# Altium schematic sheet MCU.SchDoc: MCU
size A3; Author: DODANHLUONG; Revision: 1.0; SheetNumber: 4; SheetTotal: 6; ProjectTitle: KIT ARDUINO VERSION 1.0
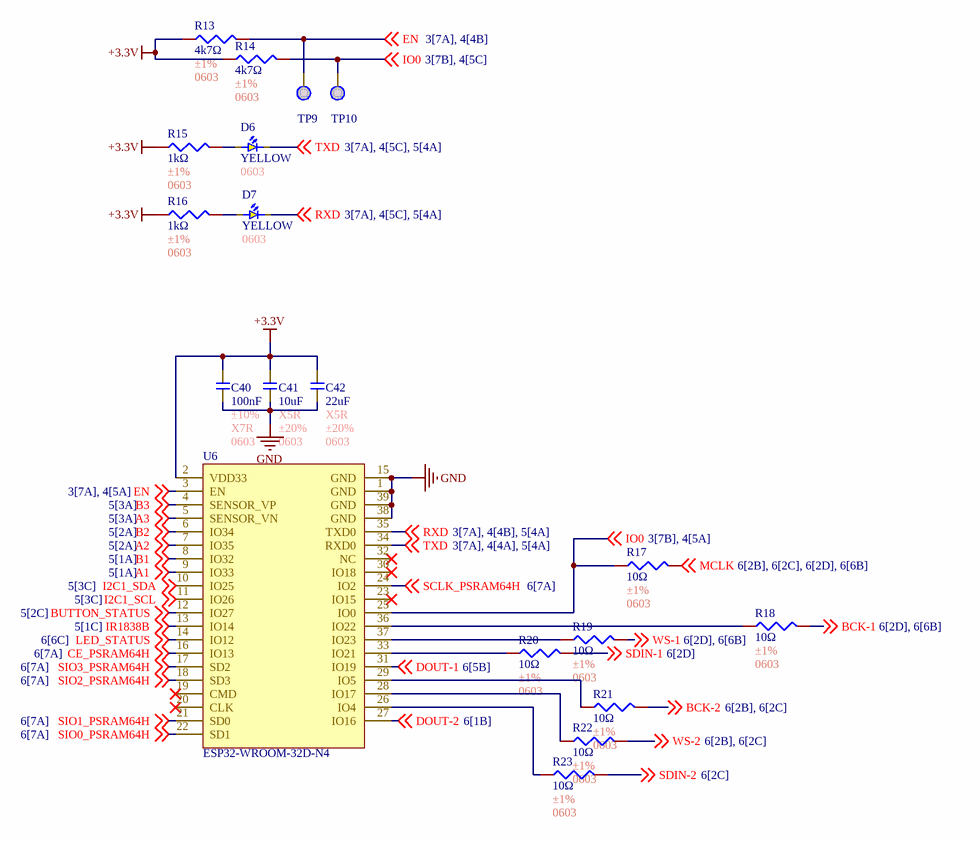
[diagram p0: MCU.SchDoc]

## Parts
C40  100nF  Tolerance: ±10%  Temperature Coefficient: X7R  Package: 0603  [C0603]
C41  10uF  Temperature Coefficient: X5R  Tolerance: ±20%  Package: 0603  [C0603]
C42  22uF  Temperature Coefficient: X5R  Tolerance: ±20%  Package: 0603  [C0603]
D6  YELLOW  Package: 0603  [LED0603]
D7  YELLOW  Package: 0603  [LED0603]
R13  4k7Ω  Tolerance: ±1%  Package: 0603  [R0603]
R14  4k7Ω  Tolerance: ±1%  Package: 0603  [R0603]
R15  1kΩ  Tolerance: ±1%  Package: 0603  [R0603]
R16  1kΩ  Tolerance: ±1%  Package: 0603  [R0603]
R17  10Ω  Tolerance: ±1%  Package: 0603  [R0603]
R18  10Ω  Tolerance: ±1%  Package: 0603  [R0603]
R19  10Ω  Tolerance: ±1%  Package: 0603  [R0603]
R20  10Ω  Tolerance: ±1%  Package: 0603  [R0603]
R21  10Ω  Tolerance: ±1%  Package: 0603  [R0603]
R22  10Ω  Tolerance: ±1%  Package: 0603  [R0603]
R23  10Ω  Tolerance: ±1%  Package: 0603  [R0603]
TP9  TP  [TP]  (value not drawn)
TP10  TP  [TP]  (value not drawn)
U6  ESP32-WROOM-32D-N4  [ESP32-WROOM-32D-N4]

## Nets
+3.3V: C40.2 C41.2 C42.2 R13.1 R14.1 R15.1 R16.1 U6.2(VDD33)
GND: C40.1 C41.1 C42.1 U6.1(GND) U6.15(GND) U6.38(GND) U6.39(GND)
A1: U6.9(IO33) ; off-sheet A1
A2: U6.7(IO35) ; off-sheet A2
A3: U6.5(SENSOR_VN) ; off-sheet A3
B1: U6.8(IO32) ; off-sheet B1
B2: U6.6(IO34) ; off-sheet B2
B3: U6.4(SENSOR_VP) ; off-sheet B3
BCK-1: R18.2 ; off-sheet BCK-1
BCK-2: R21.2 ; off-sheet BCK-2
BUTTON_STATUS: U6.12(IO27) ; off-sheet BUTTON_STATUS
CE_PSRAM64H: U6.16(IO13) ; off-sheet CE_PSRAM64H
DOUT-1: U6.31(IO19) ; off-sheet DOUT-1
DOUT-2: U6.27(IO16) ; off-sheet DOUT-2
EN: R13.2 TP9.1 U6.3(EN) ; off-sheet EN
I2C1_SCL: U6.11(IO26) ; off-sheet I2C1_SCL
I2C1_SDA: U6.10(IO25) ; off-sheet I2C1_SDA
IO0: R14.2 R17.1 TP10.1 U6.25(IO0) ; off-sheet IO0
IR1838B: U6.13(IO14) ; off-sheet IR1838B
LED_STATUS: U6.14(IO12) ; off-sheet LED_STATUS
MCLK: R17.2 ; off-sheet MCLK
RXD: D7.1 U6.35(TXD0) ; off-sheet RXD
SCLK_PSRAM64H: U6.24(IO2) ; off-sheet SCLK_PSRAM64H
SDIN-1: R20.2 ; off-sheet SDIN-1
SDIN-2: R23.2 ; off-sheet SDIN-2
SIO0_PSRAM64H: U6.22(SD1) ; off-sheet SIO0_PSRAM64H
SIO1_PSRAM64H: U6.21(SD0) ; off-sheet SIO1_PSRAM64H
SIO2_PSRAM64H: U6.18(SD3) ; off-sheet SIO2_PSRAM64H
SIO3_PSRAM64H: U6.17(SD2) ; off-sheet SIO3_PSRAM64H
TXD: D6.1 U6.34(RXD0) ; off-sheet TXD
WS-1: R19.2 ; off-sheet WS-1
WS-2: R22.2 ; off-sheet WS-2
NetD6_2: D6.2 R15.2
NetD7_2: D7.2 R16.2
NetR18_1: R18.1 U6.36(IO22)
NetR19_1: R19.1 U6.37(IO23)
NetR20_1: R20.1 U6.33(IO21)
NetR21_1: R21.1 U6.29(IO5)
NetR22_1: R22.1 U6.28(IO17)
NetR23_1: R23.1 U6.26(IO4)

Not connected (* = marked no-connect by the designer): U6 19(CMD)* 20(CLK)* 23(IO15)* 30(IO18)* 32(NC)*

## Notes on the sheet
- Author:
- Title:
- Size:
- A3
- Project:
- Revision:
- Modified Date:
- CheckedBy:
- Date:
- SW Version:

## Library data of the parts
C40 = C0603_100nF_±10%_X7R: 50V 100nF X7R ±10% 0603 Multilayer Ceramic Capacitors MLCC - SMD/SMT ROHS; Manufacturer: YAGEO; Mfr. Part #: CC0603KRX7R9BB104; LCSC Part #: C14663; Capacitance: 100nF; Link: https://www.lcsc.com/product-detail/C14663.html?s_z=n_capital%25200603%2520100nf
C41 = C0603_10uF_±10%_X7R: 25V 10uF X5R ±20% 0603 Multilayer Ceramic Capacitors MLCC - SMD/SMT ROHS; Manufacturer: YAGEO; Mfr. Part #: CC0603MRX5R8BB106; LCSC Part #: C596327; Capacitance: 10uF; Link: https://www.lcsc.com/product-detail/C596327.html?s_z=n_capital%25200603%252010uF%2520yageo
C42 = C0603_22uF_±20%_X5R: 6.3V 22uF X5R ±20% 0603 Multilayer Ceramic Capacitors MLCC - SMD/SMT ROHS; Manufacturer: YAGEO; Mfr. Part #: CC0603MRX5R5BB226; LCSC Part #: C109448; ComponentLink1Description: New link; ComponentLink1URL: *; Capacitance: 22uF; Link: https://www.lcsc.com/product-detail/C109448.html?s_z=n_capital%25200603%252022uf%2520yageo
D6 D7 = D0603_YELLOW: 25mcd~40mcd Water Clear -40℃~+85℃ 624nm Red 120° 60mW 0402 LED Indication - Discrete ROHS; Manufacturer: XINGLIGHT; Mfr. Part #: XL-1005UGC; Voltage - Forward(Vf): 3V; LCSC Part #: C965793; Power(Watts): 60mW; Link: https://www.lcsc.com/product-detail/C136765.html?s_z=n_LED%25200402%2520RED; Illumination Color: YELLOW
R13 R14 = R0603_4k7Ω_±1%: 62.5mW Thick Film Resistor 50V ±1% ±200ppm/℃ 10Ω 0402 Chip Resistor - Surface Mount ROHS; Manufacturer: YAGEO; Mfr. Part #: RC0402FR-0710RL; LCSC Part #: C138066; Resistance: 4k7Ω; Link: https://www.lcsc.com/product-detail/C138066.html?s_z=n_resistor%25200402%252010R
R15 R16 = R0603_1kΩ_±1%: 62.5mW Thick Film Resistor 50V ±1% ±200ppm/℃ 10Ω 0402 Chip Resistor - Surface Mount ROHS; Manufacturer: YAGEO; Mfr. Part #: RC0402FR-0710RL; LCSC Part #: C138066; Resistance: 1kΩ; Link: https://www.lcsc.com/product-detail/C138066.html?s_z=n_resistor%25200402%252010R
R17-R23 = R0603_10Ω_±1%: 62.5mW Thick Film Resistor 50V ±1% ±200ppm/℃ 10Ω 0402 Chip Resistor - Surface Mount ROHS; Manufacturer: YAGEO; Mfr. Part #: RC0402FR-0710RL; LCSC Part #: C138066; Resistance: 10Ω; Link: https://www.lcsc.com/product-detail/C138066.html?s_z=n_resistor%25200402%252010R
U6 = ESPRESSIF ESP32-WROOM-32D-N4: SMD,18x25.5mm WiFi Modules ROHS; Manufacturer: ESPRESSIF; Mfr. Part #: ESP32-WROOM-32D-N4; LCSC Part #: C473012; Package: SMD,18x25.5mm; Link: https://www.lcsc.com/product-detail/C473012.html?s_z=n_esp32-wroom-32d